# Altium schematic sheet main.SchDoc
size A4
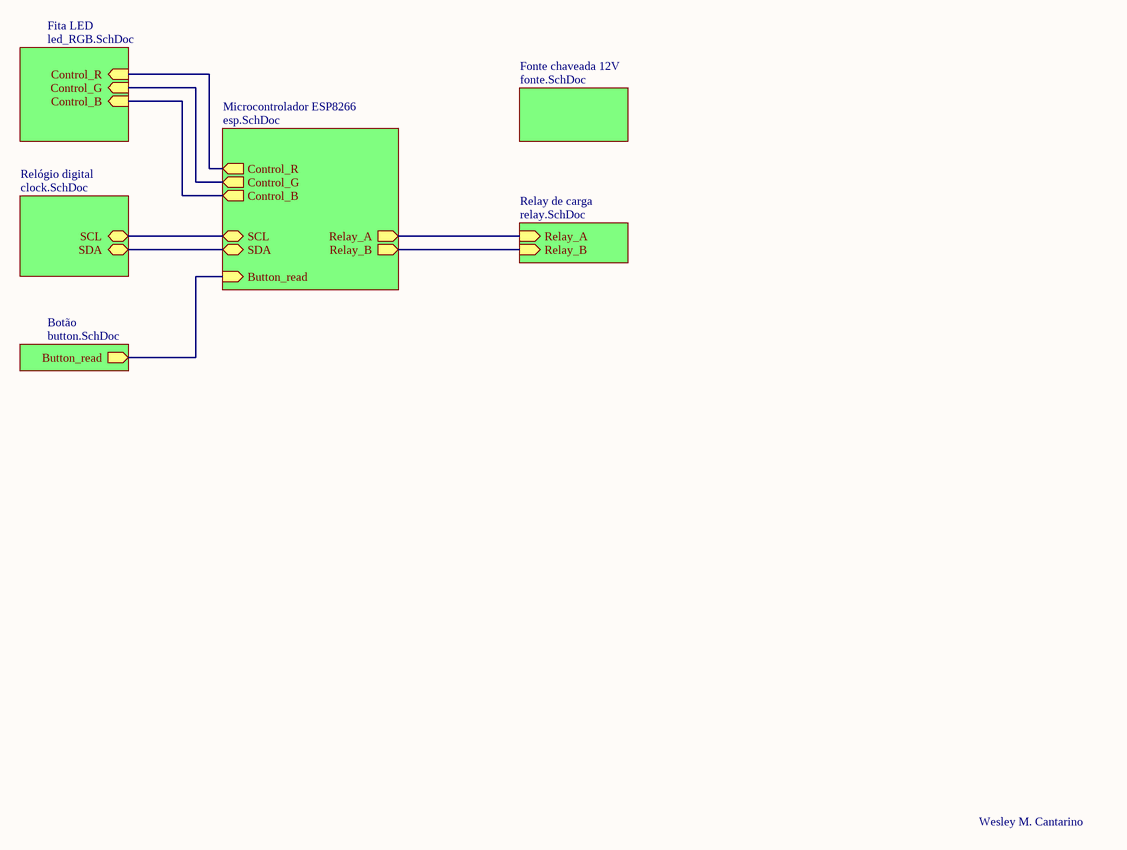
[diagram p0: main.SchDoc]

## Sub-sheets
Botão = button.SchDoc: Button_read (out)
Fita LED = led_RGB.SchDoc: Control_R (in), Control_G (in), Control_B (in)
Fonte chaveada 12V = fonte.SchDoc: no entries
Microcontrolador ESP8266 = esp.SchDoc: Control_R (out), Control_G (out), Control_B (out), Button_read (in), SCL (bidir), SDA (bidir), Relay_B (out), Relay_A (out)
Relay de carga = relay.SchDoc: Relay_A (in), Relay_B (in)
Relógio digital = clock.SchDoc: SDA (bidir), SCL (bidir)

## Nets
(unnamed): sheet Microcontrolador ESP8266/Control_R, sheet Fita LED/Control_R
(unnamed): sheet Microcontrolador ESP8266/Control_G, sheet Fita LED/Control_G
(unnamed): sheet Microcontrolador ESP8266/Control_B, sheet Fita LED/Control_B
(unnamed): sheet Microcontrolador ESP8266/Button_read, sheet Botão/Button_read
(unnamed): sheet Microcontrolador ESP8266/SCL, sheet Relógio digital/SCL
(unnamed): sheet Microcontrolador ESP8266/SDA, sheet Relógio digital/SDA
(unnamed): sheet Microcontrolador ESP8266/Relay_B, sheet Relay de carga/Relay_B
(unnamed): sheet Microcontrolador ESP8266/Relay_A, sheet Relay de carga/Relay_A

## Notes on the sheet
- Wesley M. Cantarino